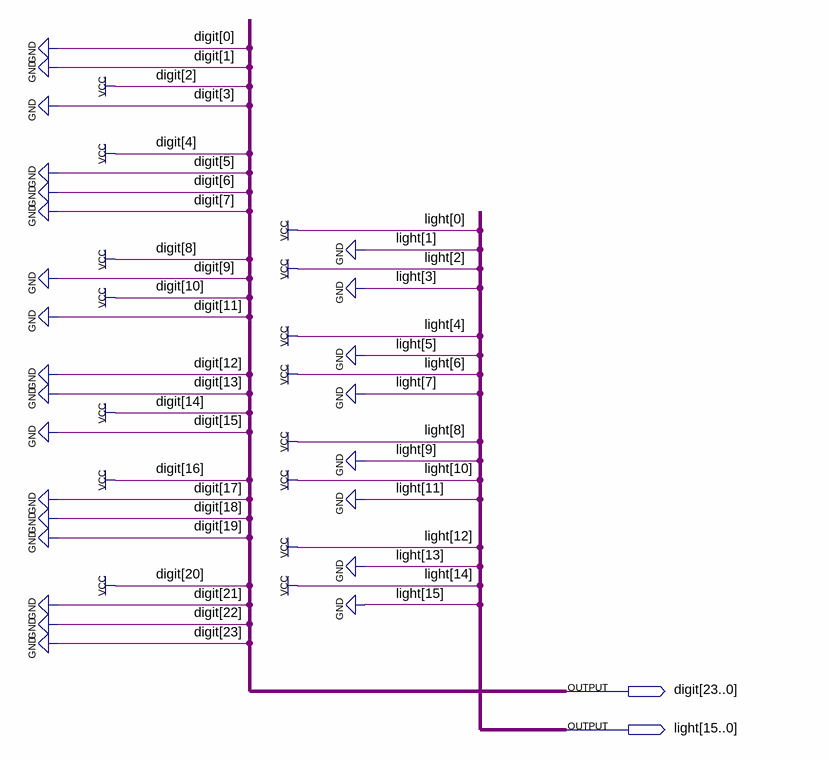
[diagram p0: schematic sheet]
// Quartus schematic Pattern_0_Frame_6.bdf as structural Verilog: 0 symbols, 2 pins
module Pattern_0_Frame_6 (
  output [23:0] digit,
  output [15:0] light
);


  assign digit = 24'b000100010100010100010100;
  assign light = 16'b0101010101010101;
endmodule
